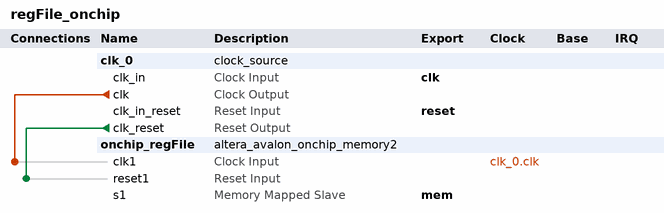
[diagram p0: system contents]
# Platform Designer (Qsys) system regFile_onchip, Cyclone V 5CSEMA5F31C6
# Parameters at their usual value, and those the tool derives, are not listed.
package require -exact qsys 18.0
create_system regFile_onchip
set_project_property DEVICE_FAMILY {Cyclone V}
set_project_property DEVICE 5CSEMA5F31C6

add_instance clk_0 clock_source 18.0
set_instance_parameter_value clk_0 clockFrequency 50000000

add_instance onchip_regFile altera_avalon_onchip_memory2 18.0
set_instance_parameter_value onchip_regFile dataWidth 32
set_instance_parameter_value onchip_regFile dualPort false
set_instance_parameter_value onchip_regFile initMemContent false
set_instance_parameter_value onchip_regFile initializationFileName onchip_mem.hex
set_instance_parameter_value onchip_regFile memorySize 128

# connections
add_connection clk_0.clk onchip_regFile.clk1 clock
add_connection clk_0.clk_reset onchip_regFile.reset1 reset

# exported interfaces
add_interface clk clock sink
set_interface_property clk EXPORT_OF clk_0.clk_in
add_interface mem avalon slave
set_interface_property mem EXPORT_OF onchip_regFile.s1
add_interface reset reset sink
set_interface_property reset EXPORT_OF clk_0.clk_in_reset

set_interconnect_requirement {$system} qsys_mm.clockCrossingAdapter HANDSHAKE
set_interconnect_requirement {$system} qsys_mm.enableEccProtection FALSE
set_interconnect_requirement {$system} qsys_mm.insertDefaultSlave FALSE
set_interconnect_requirement {$system} qsys_mm.maxAdditionalLatency 1

save_system regFile_onchip.qsys
